# Altium schematic sheet Data_Retention.SchDoc
size A4
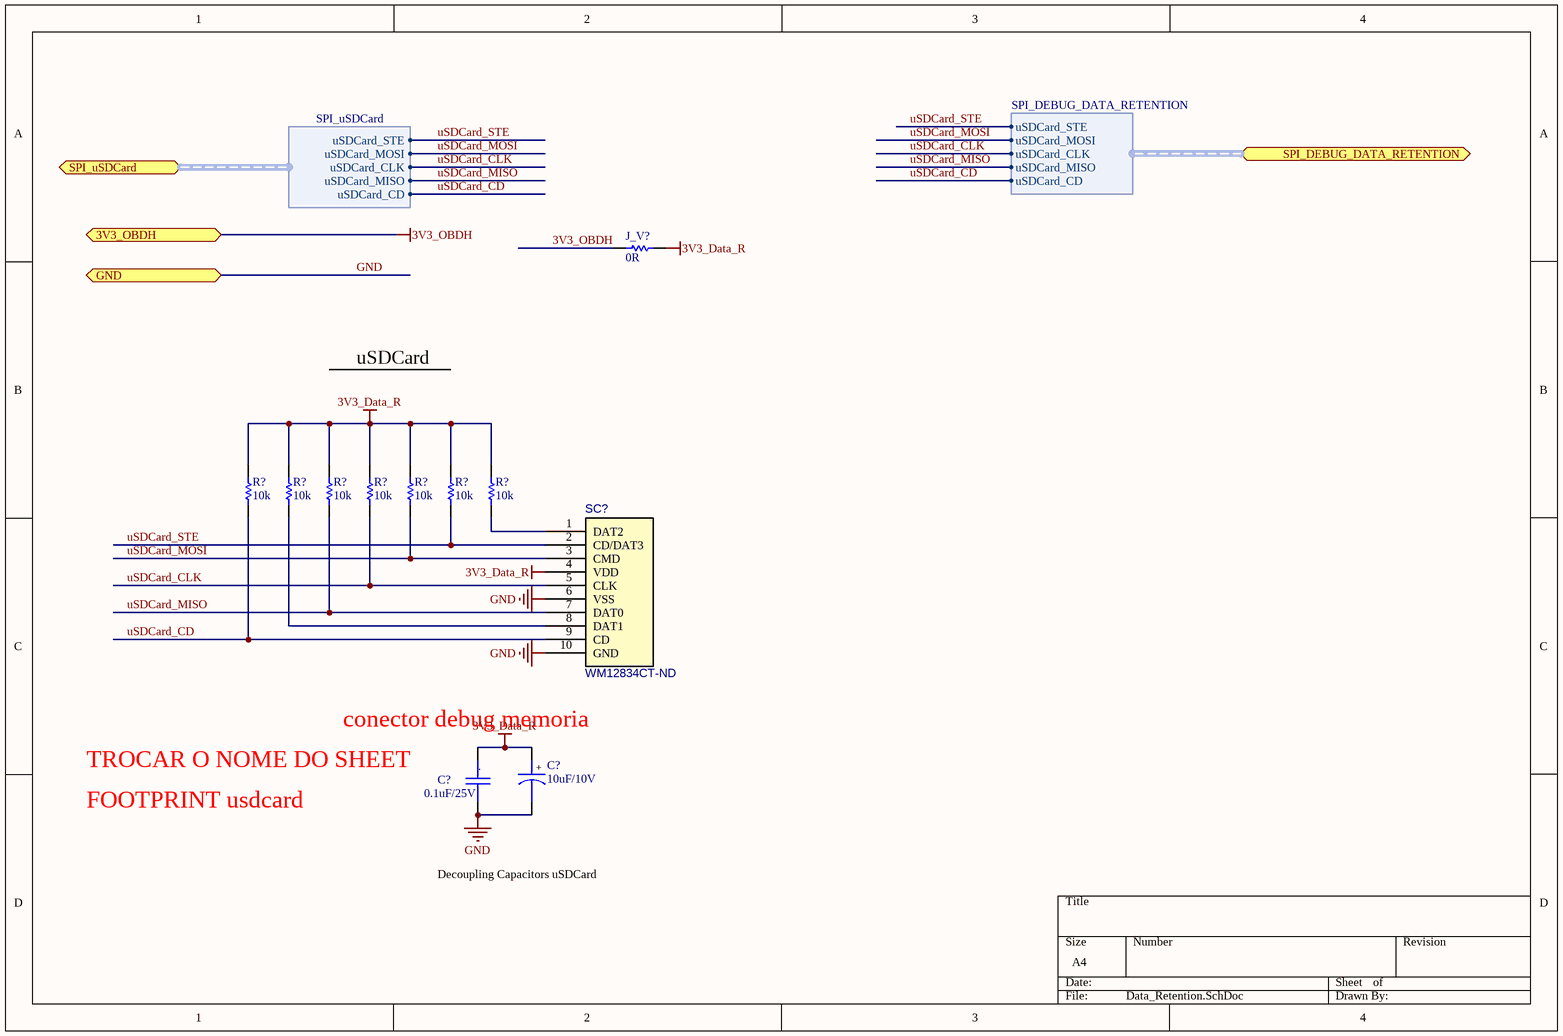
[diagram p0: Data_Retention.SchDoc]

## Parts
(Parts that share a designator on the sheet are numbered #1, #2 ... from top to bottom, then left to right.)
C?#1  0.1uF/25V  [CC0805]
C?#2  10uF/10V  [CC0805_Tantalum]
J_V?  0R  [0805]
R?#1  10k  [0805]
R?#2  10k  [0805]
R?#3  10k  [0805]
R?#4  10k  [0805]
R?#5  10k  [0805]
R?#6  10k  [0805]
R?#7  10k  [0805]
SC?  WM12834CT-ND  [SIM-CARD (0473883001)]

## Ports
3V3_OBDH, GND, SPI_DEBUG_DATA_RETENTION (harness SPI_DEBUG_DATA_RETENTION), SPI_uSDCard (harness SPI_uSDCard)

## Harnesses
SPI_uSDCard: uSDCard_STE, uSDCard_CLK, uSDCard_MISO, uSDCard_CD, uSDCard_MOSI
SPI_DEBUG_DATA_RETENTION: uSDCard_STE, uSDCard_CLK, uSDCard_MISO, uSDCard_CD, uSDCard_MOSI

## Nets
3V3_Data_R: C?#1.1 C?#2.1 J_V?.1 R?#1.2 R?#2.2 R?#3.2 R?#4.2 R?#5.2 R?#6.2 R?#7.2 SC?.4(VDD)
3V3_OBDH: J_V?.2 ; port 3V3_OBDH
GND: C?#1.2 C?#2.2 SC?.6(VSS) SC?.10(GND) ; port GND
uSDCard_CD: R?#1.1 SC?.9(CD) ; port SPI_uSDCard.uSDCard_CD, port SPI_DEBUG_DATA_RETENTION.uSDCard_CD
uSDCard_CLK: R?#4.1 SC?.5(CLK) ; port SPI_uSDCard.uSDCard_CLK, port SPI_DEBUG_DATA_RETENTION.uSDCard_CLK
uSDCard_MISO: R?#3.1 SC?.7(DAT0) ; port SPI_uSDCard.uSDCard_MISO, port SPI_DEBUG_DATA_RETENTION.uSDCard_MISO
uSDCard_MOSI: R?#5.1 SC?.3(CMD) ; port SPI_uSDCard.uSDCard_MOSI, port SPI_DEBUG_DATA_RETENTION.uSDCard_MOSI
uSDCard_STE: R?#6.1 SC?.2(CD/DAT3) ; port SPI_uSDCard.uSDCard_STE, port SPI_DEBUG_DATA_RETENTION.uSDCard_STE
NetR?#2_1: R?#2.1 SC?.8(DAT1)
NetR?#7_1: R?#7.1 SC?.1(DAT2)

## Notes on the sheet
- uSDCard
- TROCAR O NOME DO SHEET
- conector debug memoria
- FOOTPRINT usdcard
- Decoupling Capacitors uSDCard
- (in symbol Cap_Cer_X7R_0.1uF_25V_0805) .
- (in symbol Cap_Tant_SMD_10uF_10V_0805) +

## Library data of the parts
C?#1 = Cap_Cer_X7R_0.1uF_25V_0805: CAP CER 0.1UF 25V 10% X7R 0805; Partnumber: CC0805KRX7R8BB104; NCM: 8532.24.10
C?#2 = Cap_Tant_SMD_10uF_10V_0805: CAP Tantalum 10uF 10V 20% 0805; Partnumber: TPSP106M010R2000; NCM: 8532.21.11
J_V? = R0R_JUMPER_1/16W_0805: RES 0R OHM 1/16W JUMPER 0805; Partnumber: CRCW08050000Z0EA; NCM: 8533.21.20
R?#1-R?#7 = R10k_1%_1/8W_0805: RES 10K OHM 1/8W 1%  0805; Partnumber: CRCW080510K0FKEA; NCM: 8533.21.20
SC? = MicroSD_Card_Connector: MicroSD CARD Connector; Partnumber: WM12834CT-ND; NCM: 8536.90.40